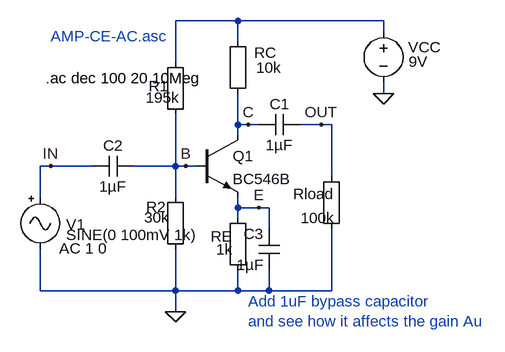
[diagram p0: schematic AMP-CE-AC.asc]
AMP-CE-AC.asc, the LTspice schematic file:
Version 4
SHEET 1 880 680
WIRE 192 -64 96 -64
WIRE 416 -64 192 -64
WIRE 416 -48 416 -64
WIRE 192 -32 192 -64
WIRE 96 0 96 -64
WIRE 416 48 416 32
WIRE 192 96 192 48
WIRE 208 96 192 96
WIRE 224 96 208 96
WIRE 320 96 288 96
WIRE 336 96 320 96
WIRE 192 112 192 96
WIRE -96 160 -112 160
WIRE -32 160 -96 160
WIRE 96 160 96 80
WIRE 96 160 32 160
WIRE 112 160 96 160
WIRE 128 160 112 160
WIRE 336 176 336 96
WIRE -112 208 -112 160
WIRE 96 208 96 160
WIRE 192 224 192 208
WIRE 224 224 192 224
WIRE 240 224 224 224
WIRE 192 240 192 224
WIRE 240 256 240 224
WIRE -112 352 -112 288
WIRE 96 352 96 288
WIRE 96 352 -112 352
WIRE 192 352 192 320
WIRE 192 352 96 352
WIRE 240 352 240 320
WIRE 240 352 192 352
WIRE 336 352 336 256
WIRE 336 352 240 352
WIRE 96 384 96 352
FLAG 416 48 0
FLAG -96 160 IN
FLAG 96 384 0
FLAG 208 96 C
FLAG 112 160 B
FLAG 224 224 E
FLAG 320 96 OUT
SYMBOL npn 128 112 R0
SYMATTR InstName Q1
SYMATTR Value BC546B
SYMBOL Misc\\EuropeanResistor 80 -16 R0
WINDOW 0 -25 53 Left 2
WINDOW 3 -30 70 Left 2
SYMATTR InstName R1
SYMATTR Value 195k
SYMBOL Misc\\EuropeanResistor 176 -48 R0
WINDOW 0 41 33 Left 2
WINDOW 3 44 56 Left 2
SYMATTR InstName RC
SYMATTR Value 10k
SYMBOL Misc\\signal -112 192 R0
WINDOW 123 29 95 Left 2
WINDOW 0 40 58 Left 2
WINDOW 3 40 74 Left 2
WINDOW 39 0 0 Left 0
SYMATTR Value2 AC 1 0
SYMATTR InstName V1
SYMATTR Value SINE(0 100mV 1k)
SYMBOL voltage 416 -64 R0
WINDOW 0 38 41 Left 2
WINDOW 3 39 63 Left 2
WINDOW 123 0 0 Left 2
WINDOW 39 0 0 Left 2
SYMATTR InstName VCC
SYMATTR Value 9V
SYMBOL Misc\\EuropeanResistor 176 224 R0
WINDOW 0 -26 44 Left 2
WINDOW 3 -17 64 Left 2
SYMATTR InstName RE
SYMATTR Value 1k
SYMBOL Misc\\EuropeanResistor 80 192 R0
WINDOW 0 -29 31 Left 2
WINDOW 3 -32 47 Left 2
SYMATTR InstName R2
SYMATTR Value 30k
SYMBOL Misc\\EuropeanResistor 320 160 R0
WINDOW 0 -43 43 Left 2
WINDOW 3 -31 80 Left 2
SYMATTR InstName Rload
SYMATTR Value 100k
SYMBOL cap 288 80 R90
WINDOW 0 0 32 VBottom 2
WINDOW 3 32 32 VTop 2
SYMATTR InstName C1
SYMATTR Value 1µF
SYMBOL cap 32 144 R90
WINDOW 0 0 32 VBottom 2
WINDOW 3 32 32 VTop 2
SYMATTR InstName C2
SYMATTR Value 1µF
SYMBOL cap 256 320 R180
WINDOW 0 24 56 Left 2
WINDOW 3 24 8 Left 2
SYMATTR InstName C3
SYMATTR Value 1µF
TEXT -104 24 Left 2 !.ac dec 100 20 10Meg
TEXT -96 -40 Left 2 ;AMP-CE-AC.asc
TEXT 208 368 Left 2 ;Add 1uF bypass capacitor\nand see how it affects the gain Au

The netlist it stands for:
* AMP-CE-AC.asc
Q1 C B E 0 BC546B
R1 N001 B 195k
RC N001 C 10k
V1 IN 0 SINE(0 100mV 1k) AC 1 0
VCC N001 0 9V
RE E 0 1k
R2 B 0 30k
Rload OUT 0 100k
C1 OUT C 1µF
C2 B IN 1µF
C3 0 E 1µF
.model NPN NPN
.model PNP PNP
.lib standard.bjt
.ac dec 100 20 10Meg
* AMP-CE-AC.asc
* Add 1uF bypass capacitor
* and see how it affects the gain Au
.backanno
.end